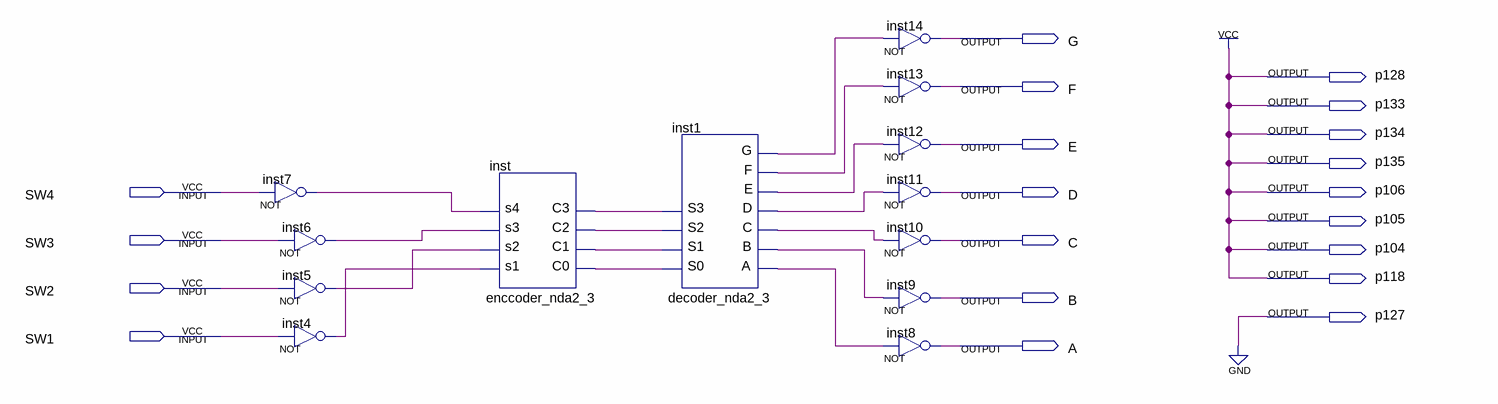
[diagram p0: schematic sheet]
// Quartus schematic stand_nda2_3.bdf as structural Verilog: 13 symbols, 20 pins
module stand_nda2_3 (
  input  SW4,
  input  SW3,
  input  SW2,
  input  SW1,
  output G,
  output p128,
  output F,
  output p133,
  output p134,
  output E,
  output p135,
  output D,
  output p106,
  output p105,
  output C,
  output p104,
  output p118,
  output B,
  output p127,
  output A
);

  wire inst1_a, inst1_b, inst1_c, inst1_d, inst1_e, inst1_f, inst1_g, inst4_out, inst5_out, inst6_out,
       inst7_out, inst_c0, inst_c1, inst_c2, inst_c3;

  not inst7 (inst7_out, SW4);
  not inst6 (inst6_out, SW3);
  not inst5 (inst5_out, SW2);
  not inst4 (inst4_out, SW1);
  enccoder_nda2_3 inst (
    .s1(inst4_out), .s2(inst5_out), .s3(inst6_out), .s4(inst7_out), .C0(inst_c0), .C1(inst_c1), .C2(inst_c2),
    .C3(inst_c3));
  decoder_nda2_3 inst1 (
    .S0(inst_c0), .S1(inst_c1), .S2(inst_c2), .S3(inst_c3), .A(inst1_a), .B(inst1_b), .C(inst1_c),
    .D(inst1_d), .E(inst1_e), .F(inst1_f), .G(inst1_g));
  not inst14 (G, inst1_g);
  not inst13 (F, inst1_f);
  not inst12 (E, inst1_e);
  not inst11 (D, inst1_d);
  not inst10 (C, inst1_c);
  not inst9 (B, inst1_b);
  not inst8 (A, inst1_a);

  assign p104 = 1'b1;
  assign p105 = 1'b1;
  assign p106 = 1'b1;
  assign p118 = 1'b1;
  assign p127 = 1'b0;
  assign p128 = 1'b1;
  assign p133 = 1'b1;
  assign p134 = 1'b1;
  assign p135 = 1'b1;
endmodule
